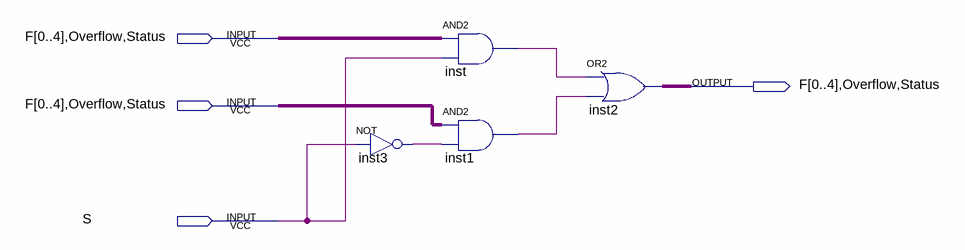
[diagram p0: schematic sheet]
// Quartus schematic mux2-1-vetor.bdf as structural Verilog: 4 symbols, 4 pins
module \mux2-1-vetor  (
  inout  [4:0] F,
  inout  Overflow,
  inout  Status,
  input  S
);

  wire inst1_out, inst3_out, inst_out;

  not inst3 (inst3_out, S);
  assign inst_out = {F[0], F[1], F[2], F[3], F[4], Overflow, Status} & {7{S}};  // AND2 inst, 7 bits wide
  assign inst1_out = {F[0], F[1], F[2], F[3], F[4], Overflow, Status} & {7{inst3_out}};  // AND2 inst1, 7 bits wide
  assign {F[0], F[1], F[2], F[3], F[4], Overflow, Status} = {7{inst_out}} | {7{inst1_out}};  // OR2 inst2, 7 bits wide
endmodule
